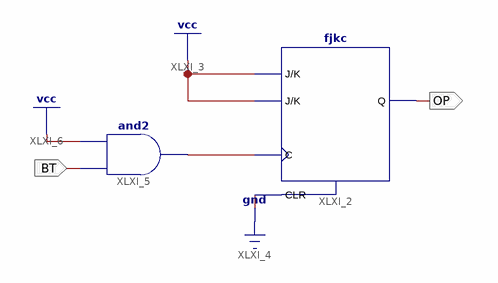
[diagram p0: schematic sheet 1]
// Xilinx ISE schematic ToggleSW.sch (spartan6) as structural Verilog: 2 symbols, 2 ports
module ToggleSW (
  input  BT,
  output OP
);

  wire XLXN_7;

  fjkc XLXI_2 (.C(XLXN_7), .CLR(1'b0), .J(1'b1), .K(1'b1), .Q(OP));
  and XLXI_5 (XLXN_7, BT, 1'b1);
endmodule
